# Altium schematic sheet DSpico.SchDoc
size A3; CompanyName: KDS; Organization: KDS; DocumentNumber: 0; Revision: V1I1; SheetNumber: 0; SheetTotal: 4; PageSetup: Record=PageOptions|CenterHorizontal=True|CenterVertical=True|PrintScale=1.07|XCorrection=1.00|YCorrection=1.00|PrintKind=1|BorderSize=5000000|LeftOffset=0|BottomOffset=0|Orientation=2|PaperLength=1000|PaperWidth=1000|Scale=100|PaperSource=7|PrintQuality=600|MediaType=1|DitherType=10|PaperKind=A3|PrintScaleMode=1; ProjectName: KDS C6A816x Module
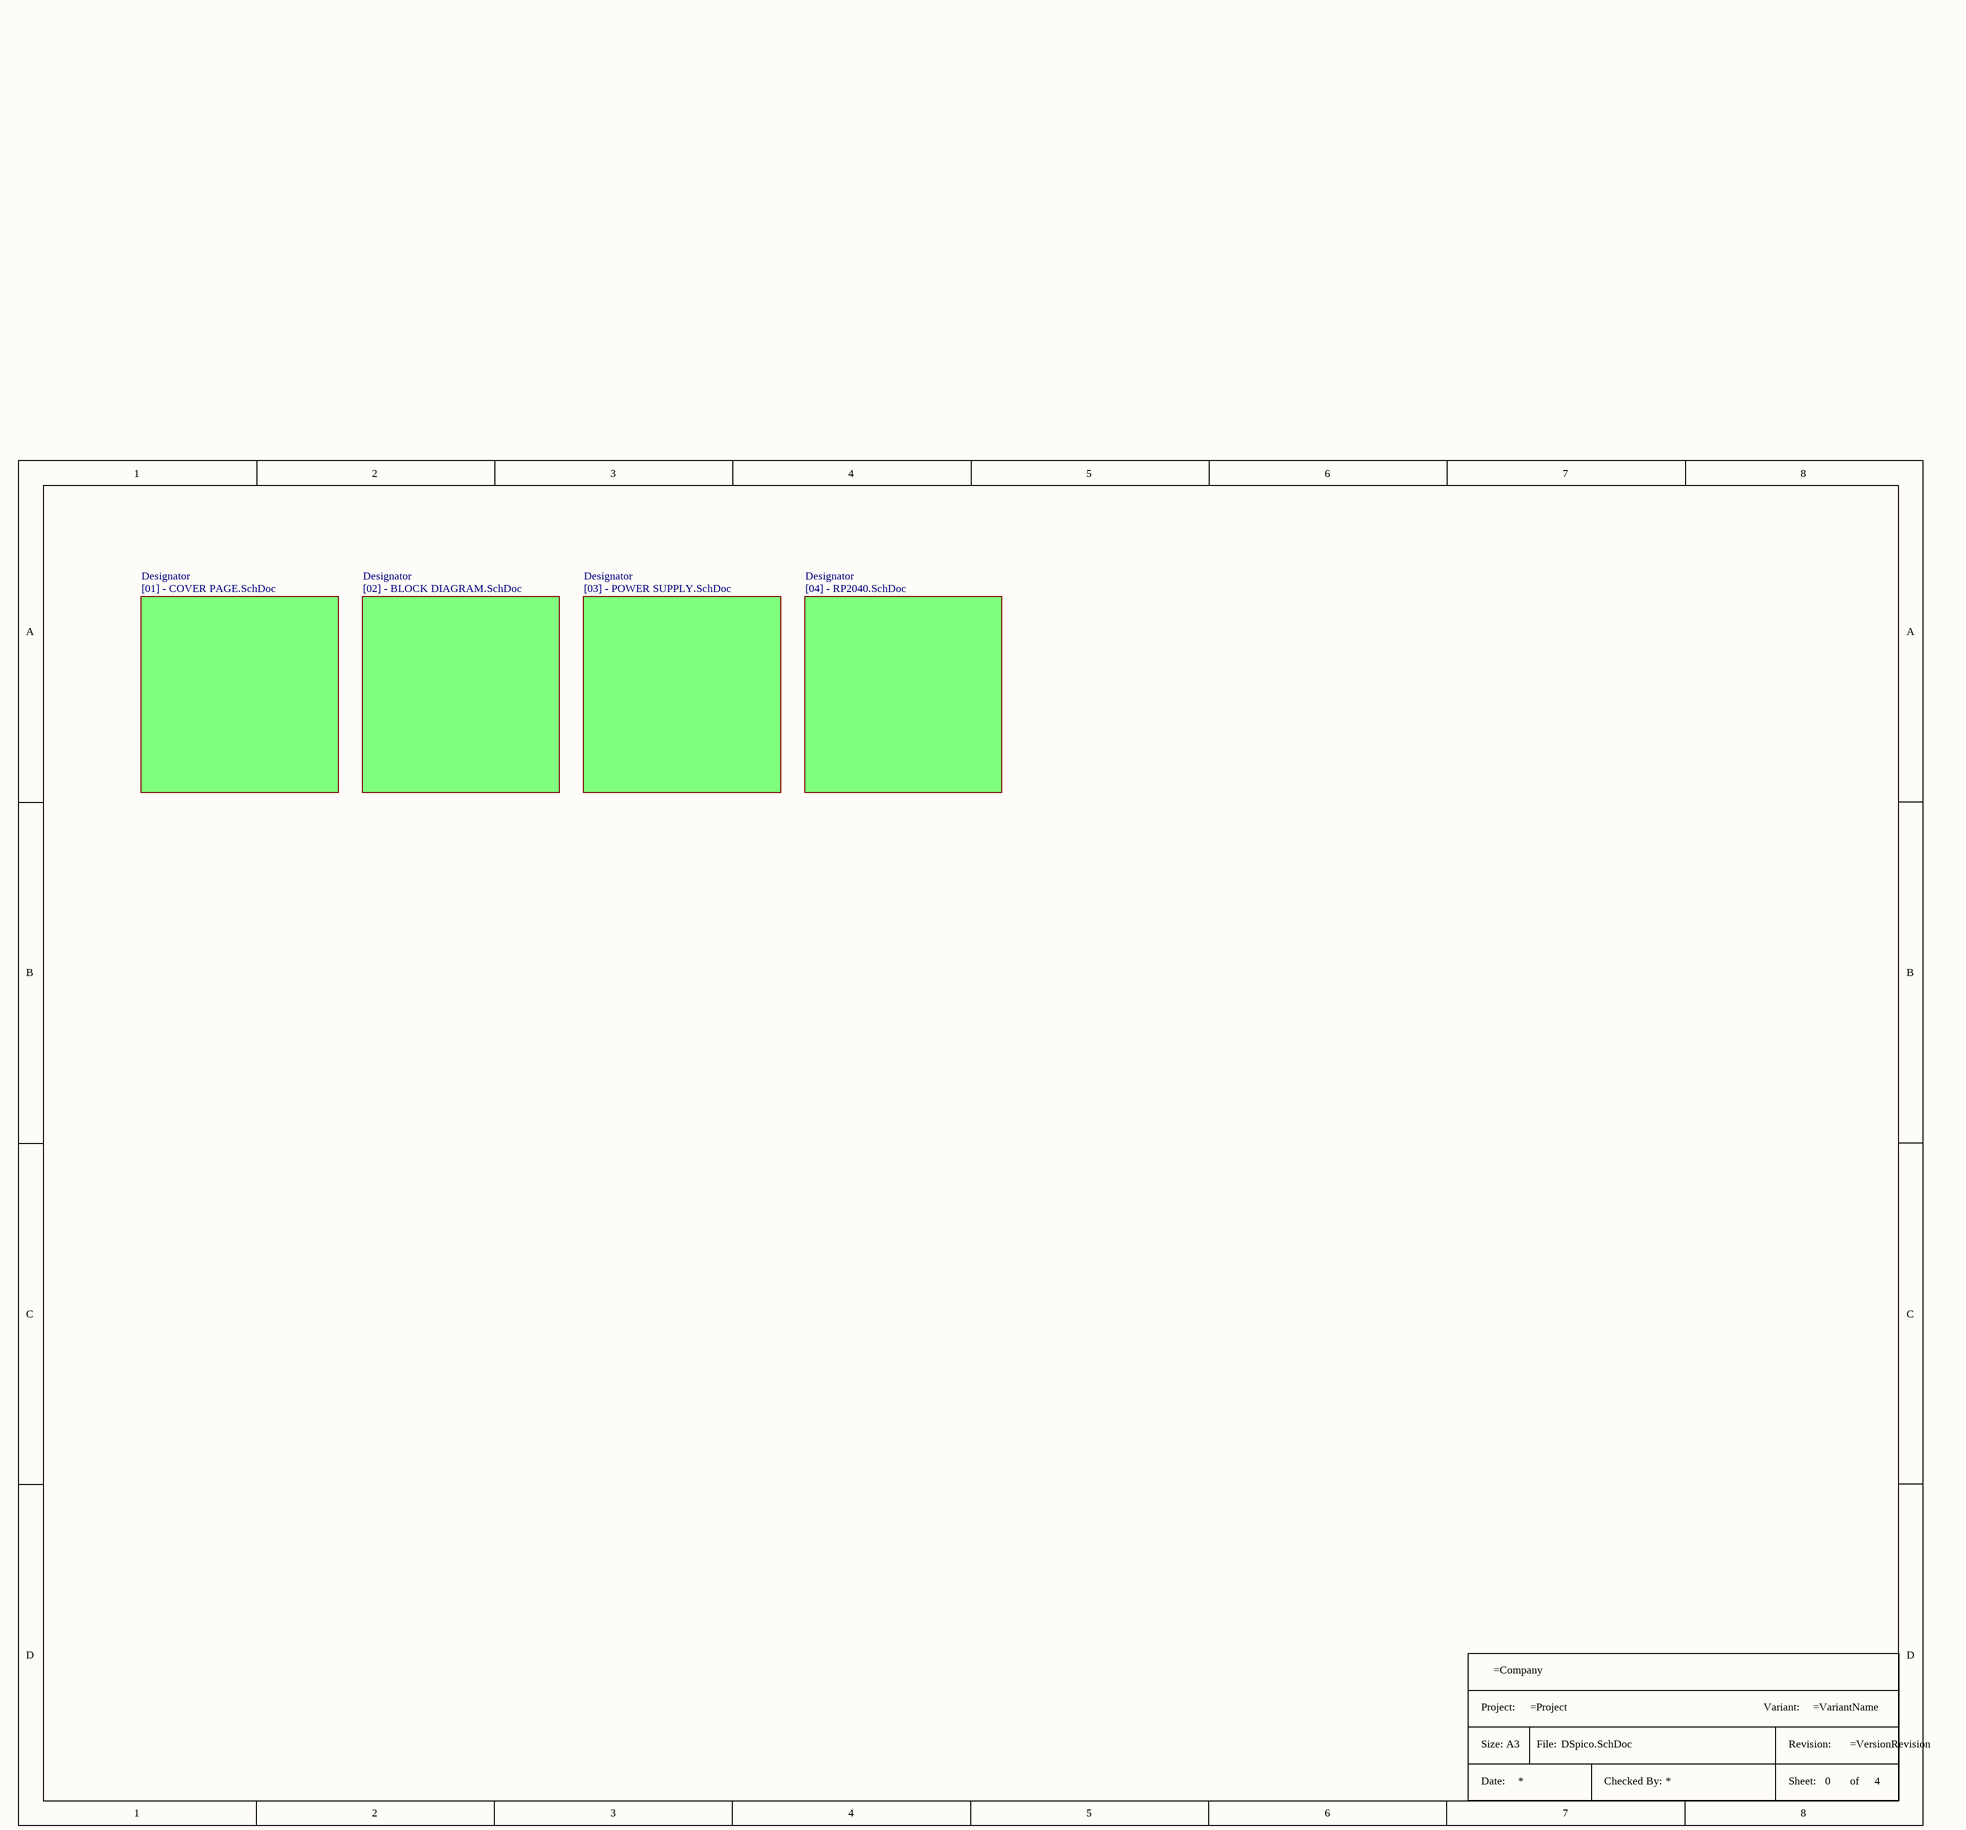
[diagram p0: DSpico.SchDoc]

## Parts
*  Title Block A3  (value not drawn)  (graphical)

## Sub-sheets
Designator = [01] - COVER PAGE.SchDoc: no entries
Designator = [03] - POWER SUPPLY.SchDoc: no entries
Designator = [02] - BLOCK DIAGRAM.SchDoc: no entries
Designator = [04] - RP2040.SchDoc: no entries

## Notes on the sheet
- (in symbol Title Block A3) Project:; Variant:; Size: A3; File:; Revision:; Date:; Checked By:; Sheet:; of